# Altium project Booster.PrjPcb
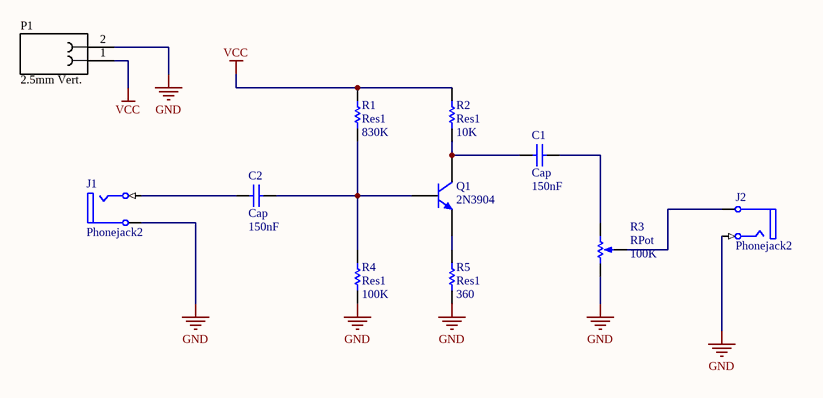
[diagram p0: LPB-1.SchDoc]
1 sheet, 11 parts. Net scope: global (net labels, ports and power ports of the same name join across sheets).
Board file: LPB-1.PcbDoc

## Sheet LPB-1.SchDoc
size A4; SheetNumber: 1; SheetTotal: 1

### Parts
C1  Cap  value 150nF  [RAD-0.3]
C2  Cap  value 150nF  [RAD-0.3]
J1  Phonejack2  [JACK/6-V2]
J2  Phonejack2  [JACK/6-V2]
P1  2.5mm Vert.  [250-402/350-604_WAG]
Q1  2N3904  [TO-92A]
R1  Res1  value 830K  [AXIAL-0.3]
R2  Res1  value 10K  [AXIAL-0.3]
R3  RPot  value 100K  [VR5]
R4  Res1  value 100K  [AXIAL-0.3]
R5  Res1  value 360  [AXIAL-0.3]

### Nets
GND: J1.5(S) J2.1(T) P1.2 R3.1(TOP) R4.1 R5.1
VCC: P1.1 R1.2 R2.2
NetC1_1: C1.1 Q1.3(C) R2.1
NetC1_2: C1.2 R3.2(BOT)
NetC2_1: C2.1 J1.1(T)
NetC2_2: C2.2 Q1.2(B) R1.1 R4.2
NetJ2_5: J2.5(S) R3.3(TAP)
NetQ1_1: Q1.1(E) R5.2

### Library data of the parts
C1 C2 = Cap: Capacitor; Published: 8-Jun-2000; LatestRevisionDate: 17-Jul-2002; LatestRevisionNote: Re-released for DXP Platform.; PackageReference: RAD-0.3; Publisher: Altium Limited; PackageDescription: Radial Cap, Thru-Hole; 2 Leads; 0.3 in Pin Spacing
J1 J2 = Phonejack2: Jack Socket, 1/4" [6.5mm], Thru-Hole, Vertical, 2-Conductor Open Circuit; PackageDocument: 2003; PCB_Layout: Complies with manufacturer's recommendation.; DrillAndSlotSize: Corresponds to nominal value.; LatestRevisionDate: 15-Jul-2004; LatestRevisionNote: Component Replaced.; DatasheetDocument: 2003; PackageReference: S1VS_SNS; Publisher: Altium Limited; ComponentLink1Description: Manufacturer Link; ComponentLink1URL: http://www.cliffuk.co.uk/
P1 = 2P_250-402/350-604_WA: PCB TERMINAL STRIPS FOR THR SOLDERING 250 SERIES; Manufacturer_A: WAGO; ComponentLink1Description: Datasheet; ComponentLink1URL: DATASHEETS\250-402/350-604.PDF; PartNumber_A: 250-402/350-604; Value_A: *; Code_A: *; Price_A: *; Purchased: *; Supplier_B: *; Code_B: *; Price_B: *; PartNumber_B: *; Value_B: *; Package_A: 2.5mm; Package_B: *; Manufacturer_B: *
Q1 = 2N3904: NPN General Purpose Amplifier; Published: 8-Jun-2000; LatestRevisionDate: 15-Jan-2003; LatestRevisionNote: PCB Footprint 'BCY-W3/D4.7' replaced; DatasheetVersion: 1997; PackageVersion: Sep-1998; PackageReference: TO-92A; Publisher: Altium Limited; PackageDescription: TO, Flat Index; 3 In-Line, Axial Leads; Body Dia. 4.5mm; Leads 0.51 x 0.48 mm (max); ComponentLink1Description: Manufacturer Link; ComponentLink1URL: http://www.fairchildsemi.com/; ComponentLink2Description: Datasheet; ComponentLink2URL: http://www.fairchildsemi.com/ds/2N%2F2N3904.pdf
R1 R2 R4 R5 = Res1: Resistor; Published: 8-Jun-2000; LatestRevisionDate: 17-Jul-2002; LatestRevisionNote: Re-released for DXP Platform.; PackageReference: AXIAL-0.3; Publisher: Altium Limited; PackageDescription: Axial Device, Thru-Hole; 2 Leads; 0.3 in Pin Spacing
R3 = RPot: Potentiometer; Sim Note: Enter the Resistance value and the set point into parameter fields.; Set Position: 0.5; Published: 8-Jun-2000; LatestRevisionDate: 17-Jul-2002; LatestRevisionNote: Re-released for DXP Platform.; PackageReference: VR5; Publisher: Altium Limited; PackageDescription: Variable Resistor, Thru-Hole; 3 Leads